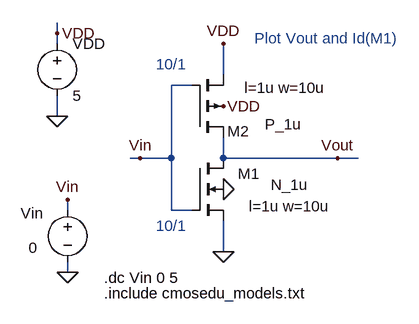
[diagram p0: schematic Fig11_4_long.asc]
Fig11_4_long.asc, the LTspice schematic file:
Version 4
SHEET 1 1136 680
WIRE 192 -368 192 -384
WIRE 192 -352 192 -368
WIRE 448 -304 448 -352
WIRE 400 -288 368 -288
WIRE 192 -240 192 -272
WIRE 320 -176 304 -176
WIRE 368 -176 368 -288
WIRE 368 -176 320 -176
WIRE 448 -176 448 -208
WIRE 624 -176 448 -176
WIRE 656 -176 624 -176
WIRE 208 -96 208 -112
WIRE 368 -96 368 -176
WIRE 400 -96 368 -96
WIRE 448 -32 448 -80
WIRE 208 0 208 -16
FLAG 208 0 0
FLAG 624 -176 Vout
FLAG 208 -112 Vin
FLAG 448 -128 0
FLAG 192 -240 0
FLAG 192 -368 VDD
FLAG 448 -256 VDD
FLAG 448 -32 0
FLAG 448 -352 VDD
FLAG 320 -176 Vin
SYMBOL nmos4 400 -176 R0
WINDOW 0 104 24 Right 2
WINDOW 3 179 41 Right 2
WINDOW 123 213 74 Right 2
SYMATTR InstName M1
SYMATTR Value N_1u
SYMATTR Value2 l=1u w=10u
SYMBOL voltage 208 -112 R0
WINDOW 0 -72 21 Left 2
WINDOW 3 -60 74 Left 2
WINDOW 123 0 0 Left 2
WINDOW 39 0 0 Left 2
SYMATTR InstName Vin
SYMATTR Value 0
SYMBOL voltage 192 -368 R0
WINDOW 123 0 0 Left 2
WINDOW 39 0 0 Left 2
SYMATTR InstName VDD
SYMATTR Value 5
SYMBOL pmos4 400 -208 M180
WINDOW 0 88 9 Right 2
WINDOW 3 168 20 Right 2
WINDOW 123 206 76 Right 2
SYMATTR InstName M2
SYMATTR Value P_1u
SYMATTR Value2 l=1u w=10u
TEXT 264 8 Left 2 !.dc Vin 0 5
TEXT 264 32 Left 2 !.include cmosedu_models.txt
TEXT 496 -360 Left 2 ;Plot Vout and Id(M1)
TEXT 344 -320 Left 2 ;10/1
TEXT 344 -72 Left 2 ;10/1

The netlist it stands for:
* Fig11_4_long.asc
M1 Vout Vin 0 0 N_1u l=1u w=10u
Vin Vin 0 0
VDD VDD 0 5
M2 Vout Vin VDD VDD P_1u l=1u w=10u
.model NMOS NMOS
.model PMOS PMOS
.lib standard.mos
.dc Vin 0 5
.include cmosedu_models.txt
* Plot Vout and Id(M1)
* 10/1
* 10/1
.backanno
.end